# EAGLE design LEOPAD (EAGLE 9.0.1)
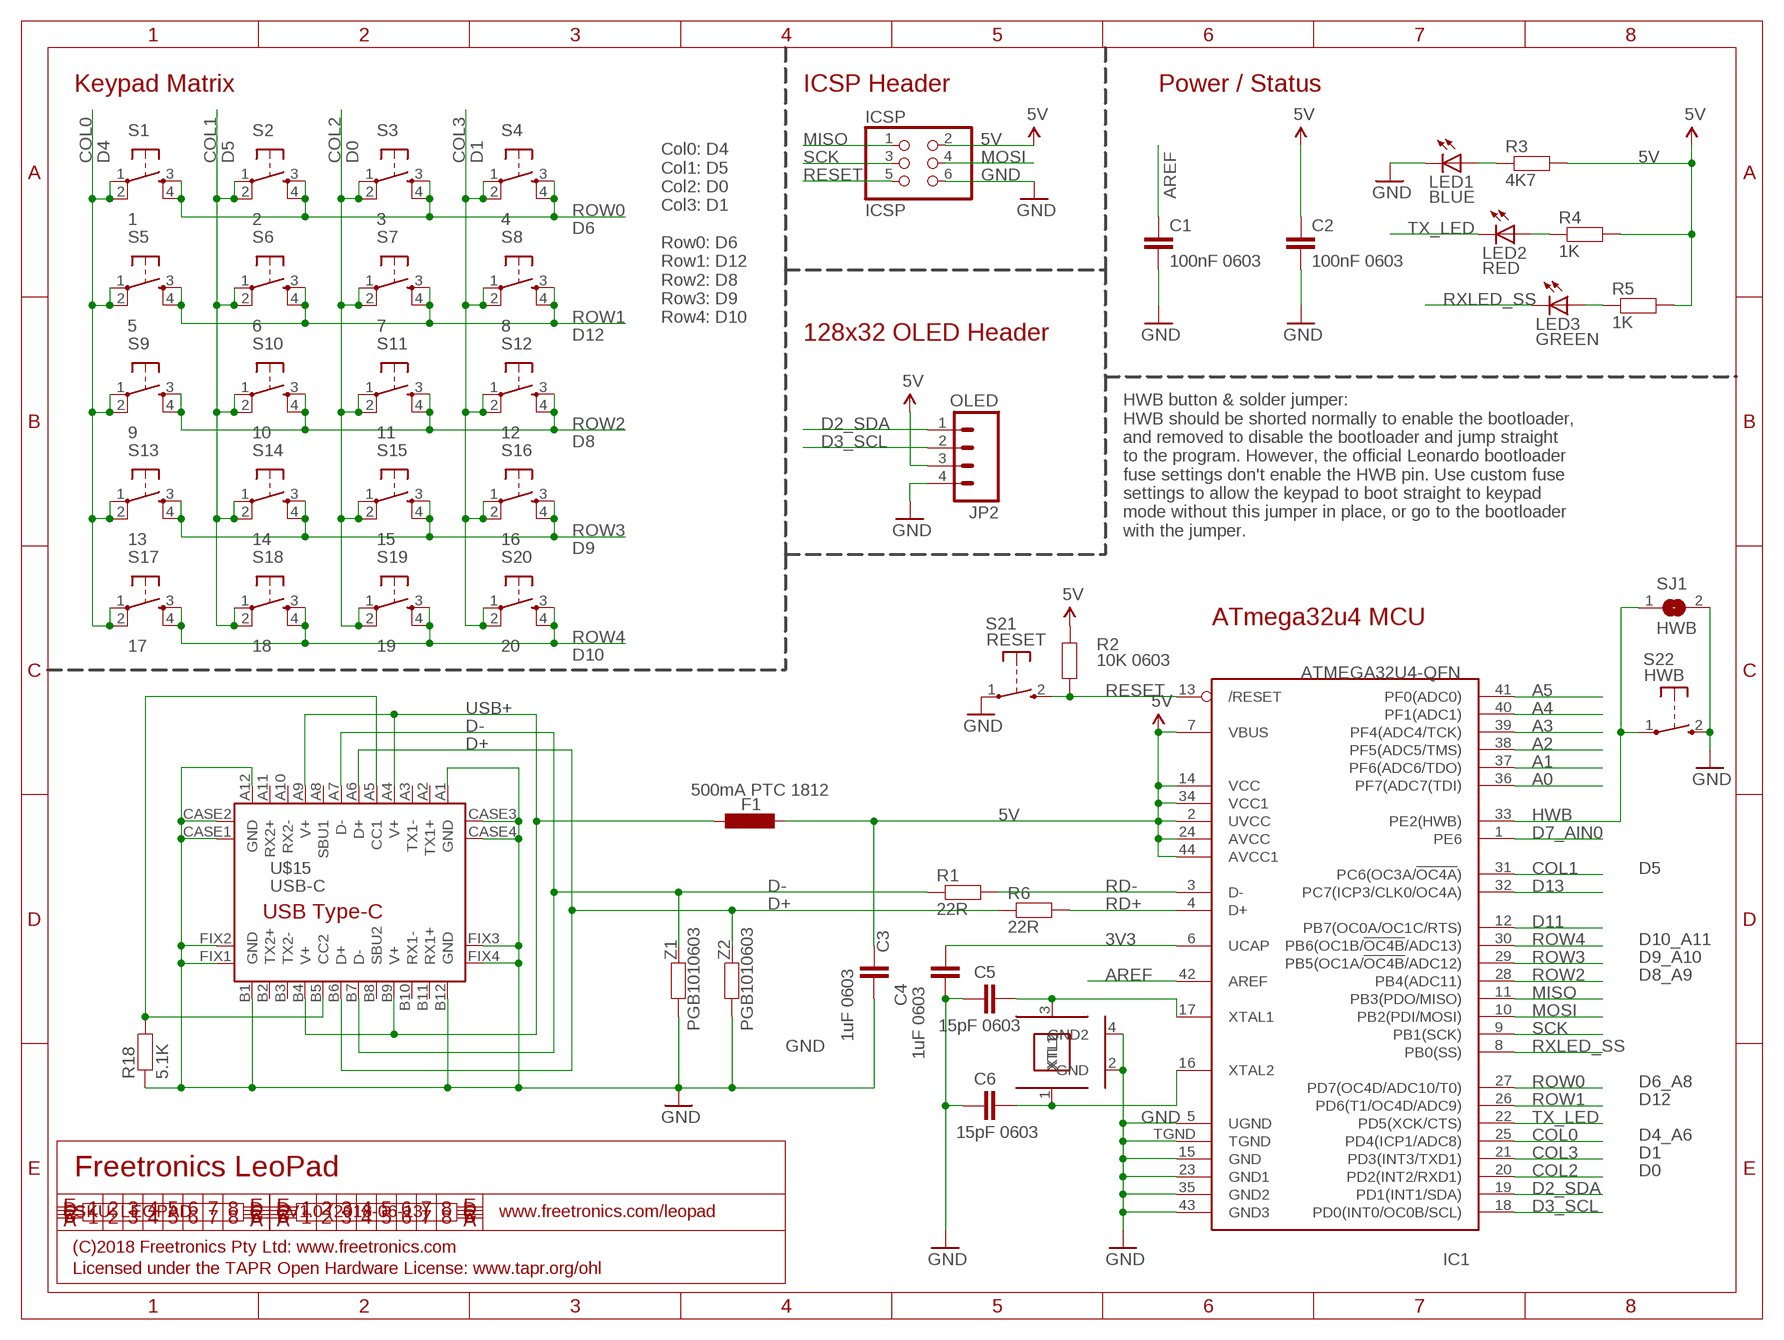
[diagram p0: schematic, sheet 1]

## Parts
C1  100nF 0603  CAP0603  [0603]
C2  100nF 0603  CAP0603  [0603]
C3  1uF 0603  CAP0603  [0603]
C4  1uF 0603  CAP0603  [0603]
C5  15pF 0603  CAP0603  [0603]
C6  15pF 0603  CAP0603  [0603]
F1  500mA PTC 1812  L-EUL1812  [L1812]
IC1  ATMEGA32U4-QFN  [QFN-44N]
ICSP  ICSP  PINHD-2X3  [2X03]
JP2  OLED  M04PTH  [1X04]
LED1  BLUE  LED0603  [LED-0603]
LED2  RED  LED0603  [LED-0603]
LED3  GREEN  LED0603  [LED-0603]
R1  22R  RESISTOR0603  [0603]
R2  10K 0603  RESISTOR0603  [0603]
R3  4K7  RESISTOR0603  [0603]
R4  1K  RESISTOR0603  [0603]
R5  1K  RESISTOR0603  [0603]
R6  22R  RESISTOR0603  [0603]
R18  5.1K  RESISTOR0603  [0603]
S1  1  TAC_SWITCH12  [TACTILE-PTH-12MM]
S2  2  TAC_SWITCH12  [TACTILE-PTH-12MM]
S3  3  TAC_SWITCH12  [TACTILE-PTH-12MM]
S4  4  TAC_SWITCH12  [TACTILE-PTH-12MM]
S5  5  TAC_SWITCH12  [TACTILE-PTH-12MM]
S6  6  TAC_SWITCH12  [TACTILE-PTH-12MM]
S7  7  TAC_SWITCH12  [TACTILE-PTH-12MM]
S8  8  TAC_SWITCH12  [TACTILE-PTH-12MM]
S9  9  TAC_SWITCH12  [TACTILE-PTH-12MM]
S10  10  TAC_SWITCH12  [TACTILE-PTH-12MM]
S11  11  TAC_SWITCH12  [TACTILE-PTH-12MM]
S12  12  TAC_SWITCH12  [TACTILE-PTH-12MM]
S13  13  TAC_SWITCH12  [TACTILE-PTH-12MM]
S14  14  TAC_SWITCH12  [TACTILE-PTH-12MM]
S15  15  TAC_SWITCH12  [TACTILE-PTH-12MM]
S16  16  TAC_SWITCH12  [TACTILE-PTH-12MM]
S17  17  TAC_SWITCH12  [TACTILE-PTH-12MM]
S18  18  TAC_SWITCH12  [TACTILE-PTH-12MM]
S19  19  TAC_SWITCH12  [TACTILE-PTH-12MM]
S20  20  TAC_SWITCH12  [TACTILE-PTH-12MM]
S21  RESET  TAC_SWITCH_2PINSMT  [TACTILE_SWITCH_SMD_2PIN_TINY]
S22  HWB  TAC_SWITCH_2PINSMT  [TACTILE_SWITCH_SMD_2PIN_TINY]
SJ1  HWB  SJN  [SJ]
U$15  USB-C  [USB-C-U52A]
XTL1  16MHz  CRYSTAL-GND3X2  [CRYSTAL-SMD-3X2]
Z1  PGB1010603  RESISTOR0603  [0603]
Z2  PGB1010603  RESISTOR0603  [0603]

## Nets
3V3: C4.2 IC1.6(UCAP)
5V: C2.1 C3.1 F1.2 IC1.2(UVCC) IC1.7(VBUS) IC1.14(VCC) IC1.24(AVCC) IC1.34(VCC1) IC1.44(AVCC1) ICSP.2 JP2.3 R2.2 R3.2 R4.2 R5.2
A0: IC1.36(PF7(ADC7(TDI))
A1: IC1.37(PF6(ADC6/TDO))
A2: IC1.38(PF5(ADC5/TMS))
A3: IC1.39(PF4(ADC4/TCK))
A4: IC1.40(PF1(ADC1))
A5: IC1.41(PF0(ADC0))
AREF: C1.1 IC1.42(AREF)
COL0: IC1.25(PD4(ICP1/ADC8)) S1.1 S1.2 S5.1 S5.2 S9.1 S9.2 S13.1 S13.2 S17.1 S17.2
COL1: IC1.31(PC6(OC3A/!OC4A!)) S2.1 S2.2 S6.1 S6.2 S10.1 S10.2 S14.1 S14.2 S18.1 S18.2
COL2: IC1.20(PD2(INT2/RXD1)) S3.1 S3.2 S7.1 S7.2 S11.1 S11.2 S15.1 S15.2 S19.1 S19.2
COL3: IC1.21(PD3(INT3/TXD1)) S4.1 S4.2 S8.1 S8.2 S12.1 S12.2 S16.1 S16.2 S20.1 S20.2
D2_SDA: IC1.19(PD1(INT1/SDA)) JP2.1
D3_SCL: IC1.18(PD0(INT0/OC0B/SCL)) JP2.2
D7_AIN0: IC1.1(PE6)
D11: IC1.12(PB7(OC0A/OC1C/RTS))
D13: IC1.32(PC7(ICP3/CLK0/OC4A))
D+: R6.1 U$15.A6(D+) U$15.B6(D+) Z2.2
D-: R1.1 U$15.A7(D-) U$15.B7(D-) Z1.2
GND: C1.2 C2.2 C3.2 C4.1 C5.1 C6.1 IC1.5(UGND) IC1.15(GND) IC1.23(GND1) IC1.35(GND2) IC1.43(GND3) IC1.TGND ICSP.6 JP2.4 LED1.C R18.1 S21.1(P) S22.2(S) SJ1.2 U$15.A1(GND) U$15.A12(GND) U$15.B1(GND) U$15.B12(GND) U$15.CASE1(GND) U$15.CASE2(GND) U$15.CASE3(GND) U$15.CASE4(GND) U$15.FIX1(GND) U$15.FIX2(GND) U$15.FIX3(GND) U$15.FIX4(GND) XTL1.2(GND) XTL1.4(GND2) Z1.1 Z2.1
HWB: IC1.33(PE2(HWB)) S22.1(P) SJ1.1
MISO: IC1.11(PB3(PDO/MISO)) ICSP.1
MOSI: IC1.10(PB2(PDI/MOSI)) ICSP.4
N$6: LED1.A R3.1
N$7: LED2.A R4.1
N$8: LED3.A R5.1
N$11: C5.2 IC1.17(XTAL1) XTL1.3(XTL2)
N$12: C6.2 IC1.16(XTAL2) XTL1.1(XTL1)
N$67: R18.2 U$15.A5(CC1) U$15.B5(CC2)
RD+: IC1.4(D+) R6.2
RD-: IC1.3(D-) R1.2
RESET: IC1.13(/RESET) ICSP.5 R2.1 S21.2(S)
ROW0: IC1.27(PD7(OC4D/ADC10/T0)) S1.3 S1.4 S2.3 S2.4 S3.3 S3.4 S4.3 S4.4
ROW1: IC1.26(PD6(T1/OC4D/ADC9)) S5.3 S5.4 S6.3 S6.4 S7.3 S7.4 S8.3 S8.4
ROW2: IC1.28(PB4(ADC11)) S9.3 S9.4 S10.3 S10.4 S11.3 S11.4 S12.3 S12.4
ROW3: IC1.29(PB5(OC1A/!OC4B!/ADC12)) S13.3 S13.4 S14.3 S14.4 S15.3 S15.4 S16.3 S16.4
ROW4: IC1.30(PB6(OC1B/!OC4B!/ADC13)) S17.3 S17.4 S18.3 S18.4 S19.3 S19.4 S20.3 S20.4
RXLED_SS: IC1.8(PB0(SS)) LED3.C
SCK: IC1.9(PB1(SCK)) ICSP.3
TX_LED: IC1.22(PD5(XCK/CTS)) LED2.C
USB+: F1.1 U$15.A4(V+) U$15.A9(V+) U$15.B4(V+) U$15.B9(V+)
Unconnected: U$15.A2(TX1+) U$15.A3(TX1-) U$15.A8(SBU1) U$15.A10(RX2-) U$15.A11(RX2+) U$15.B2(TX2+) U$15.B3(TX2-) U$15.B8(SBU2) U$15.B10(RX1-) U$15.B11(RX1+)

## Notes on the sheet
- Keypad Matrix | ICSP Header | Power / Status
- D4 | D5 | D0 | D1
- D6
- Col0: D4
  Col1: D5
  Col2: D0
  Col3: D1
  
  Row0: D6
  Row1: D12
  Row2: D8
  Row3: D9
  Row4: D10
- D12 | 128x32 OLED Header
- D8
- HWB button & solder jumper:
  HWB should be shorted normally to enable the bootloader,
  and removed to disable the bootloader and jump straight
  to the program. However, the official Leonardo bootloader
  fuse settings don't enable the HWB pin. Use custom fuse
  settings to allow the keypad to boot straight to keypad
  mode without this jumper in place, or go to the bootloader
  with the jumper.
- D9
- ATmega32u4 MCU
- D10
- D5
- D10_A11
- D9_A10
- D8_A9
- D6_A8
- D12
- D4_A6
- D1
- Freetronics LeoPad | D0
- SKU: LEOPAD | V1.0 (2018-06-13) | www.freetronics.com/leopad
- (C)2018 Freetronics Pty Ltd: www.freetronics.com
- Licensed under the TAPR Open Hardware License: www.tapr.org/ohl

## Library data of the parts
C1-C6 = freetronics-master-v1.1:CAP: Capacitor Standard 0603 ceramic capacitor, and 0.1" leaded capacitor.
F1 = rcl:L-EU: INDUCTOR, European symbol
IC1 = freetronics-jon:ATMEGA32U4: ATMEGA32U4
ICSP = pinhead:PINHD-2X3: PIN HEADER
JP2 = freetronics-jon:M04: Header 4 Standard 4-pin 0.1" header. Use with straight break away headers (SKU : PRT-00116), right angle break away headers (PRT-00553), swiss pins (PRT-00743), machine pins (PRT-00117), and female headers (PRT-00115). Molex polarized connector foot print use with SKU : PRT-08231 with associated crimp pins and housings. 1MM SMD Version SKU: PRT-10208
LED1-LED3 = freetronics-jon:LED: LEDs Standard schematic elements and footprints for 5mm, 3mm, 1206, and 0603 sized LEDs. 5mm - Spark Fun Electronics SKU : COM-00529 (and others)
R1 R3-R6 = freetronics-jon:RESISTOR: Resistor Basic schematic elements and footprints for 0603, 1206, and PTH 1/10th watt (small) resistors.
R2 Z1 Z2 = freetronics-master-v1.1:RESISTOR: Resistor Basic schematic elements and footprints for 0603, 1206, and PTH 1/10th watt (small) resistors.
R18 = freetronics-original:RESISTOR: Resistor Basic schematic elements and footprints for 0603, 1206, and PTH 1/10th watt (small) resistors.
S1-S20 = freetronics-jon:TAC_SWITCH: Momentary Switch Button commonly used for reset or general input. Spark Fun Electronics SKU : COM-00097
S21 S22 = freetronics-jon:TAC_SWITCH_2PIN: Momentary Tactile Switch - 2 pin
SJ1 = freetronics-jon:SJ: SMD solder JUMPER
U$15 = freetronics-jon:USB-C
XTL1 = freetronics-jon:CRYSTAL-GND

## Net classes
0 default: width 0.152 mm, drill 0.241 mm, clearance 0.152 mm

## Board
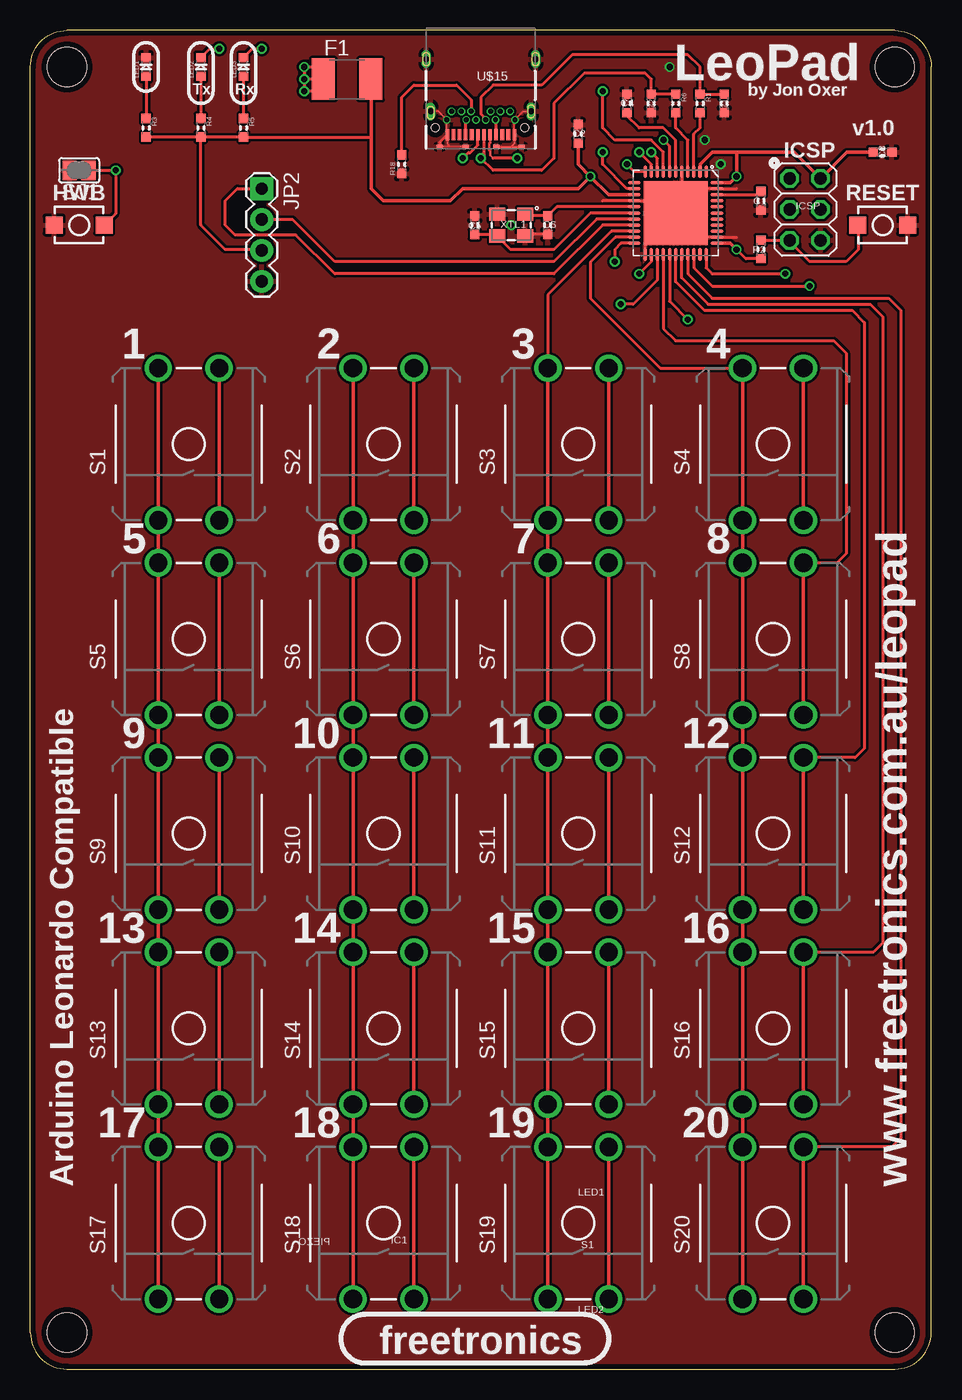
[diagram p1: board, top side]
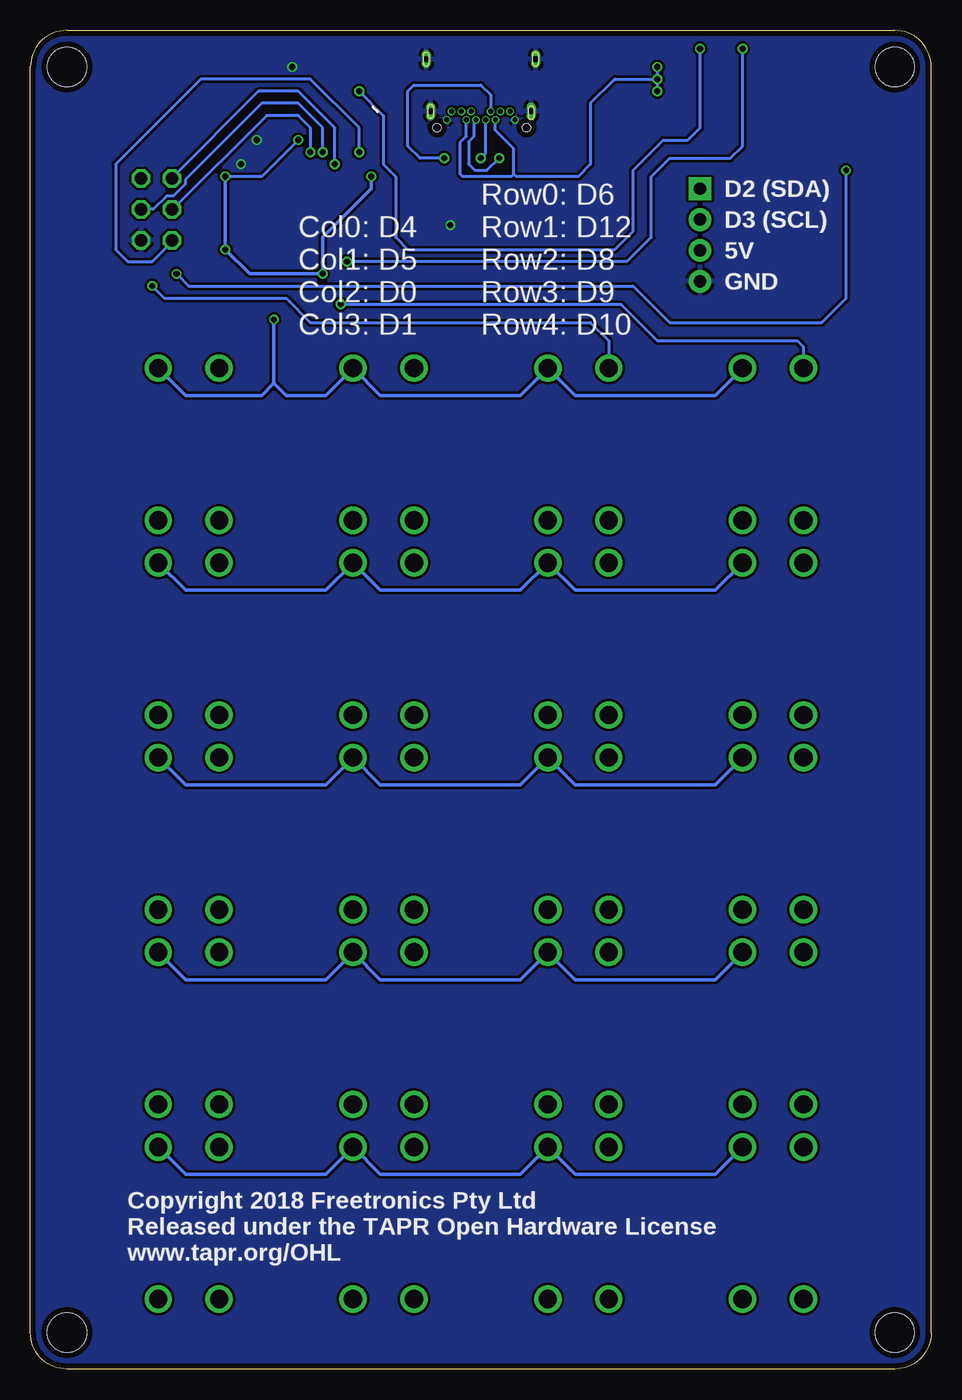
[diagram p2: board, bottom side, seen from below]

Size 74 x 110 mm. Coordinates in mm from the lower left corner, seen from the top.
Outline: 3,0 71,0 arc90 74,3 74,107 arc90 71,110 3,110 arc90 0,107 0,3 arc90 3,0
Copper layers (1*16): Top 0.035mm / dielectric 1.5mm / Bottom 0.035mm
Design rules "freetronics-design-rules": minimum track width 8mil, minimum drill 15mil, track to track 8mil, track to pad 8mil, pad to pad 8mil, via to via 8mil, smd to smd 6mil, copper to edge 18mil, drill to drill 8mil, minimum pad ring 4mil, minimum via ring 6mil, stop-mask expansion 4mil, vias tented up to drill 25mil, thermal gap 10mil
Holes 3.2 mm at 3,107 71,107 3,3 71,3

### Footprints (pad centres in the part's own frame; a part is rotated, then mirrored left to right if it is on the bottom)
0603 = smd 0.762 x 0.762: 1 -0.762,0; 2 0.762,0
L1812 = smd 1.9 x 3.4: 1 -1.95,0; 2 1.95,0
QFN-44N = smd 0.3 x 1.05: 1 -2.5,-3.4; 2 -2,-3.4; 3 -1.5,-3.4; 4 -1,-3.4; 5 -0.5,-3.4; 6 0,-3.4; 7 0.5,-3.4; 8 1,-3.4; 9 1.5,-3.4; 10 2,-3.4; 11 2.5,-3.4; 23 2.5,3.4; 24 2,3.4; 25 1.5,3.4; 26 1,3.4; 27 0.5,3.4; 28 0,3.4; 29 -0.5,3.4; 30 -1,3.4; 31 -1.5,3.4; 32 -2,3.4; 33 -2.5,3.4 | smd 1.05 x 0.3: 12 3.4,-2.5; 13 3.4,-2; 14 3.4,-1.5; 15 3.4,-1; 16 3.4,-0.5; 17 3.4,0; 18 3.4,0.5; 19 3.4,1; 20 3.4,1.5; 21 3.4,2; 22 3.4,2.5; 34 -3.4,2.5; 35 -3.4,2; 36 -3.4,1.5; 37 -3.4,1; 38 -3.4,0.5; 39 -3.4,0; 40 -3.4,-0.5; 41 -3.4,-1; 42 -3.4,-1.5; 43 -3.4,-2; 44 -3.4,-2.5 | smd 5.25 x 5.25: TGND 0,0
2X03 = drill 1.016 octagon: 1 -2.54,-1.27; 2 -2.54,1.27; 3 0,-1.27; 4 0,1.27; 5 2.54,-1.27; 6 2.54,1.27
1X04 = drill 1.016 pad 1.88 square: 1 0,0 | drill 1.016 pad 1.88: 2 2.54,0; 3 5.08,0; 4 7.62,0
LED-0603 = smd 0.762 x 0.762: A -0.762,0; C 0.762,0
TACTILE-PTH-12MM = drill 1.5: 1 -6.25,2.5; 2 6.25,2.5; 3 -6.25,-2.5; 4 6.25,-2.5
TACTILE_SWITCH_SMD_2PIN_TINY = smd 1.4 x 1.4: 1 -2.05,0; 2 2.05,0
SJ = smd 1.168 x 1.6: 1 -0.762,0; 2 0.762,0
USB-C-U52A = smd 0.3 x 0.9: A1 0.85,0.56; A2 1.35,0.56; A3 1.85,0.56; A4 2.35,0.56; A5 2.85,0.56; A6 3.35,0.56; A7 3.85,0.56; A8 4.35,0.56; A9 4.85,0.56; A10 5.35,0.56; A11 5.85,0.56; A12 6.35,0.56 | drill 0.4 pad 0.6: B1 6.4,-0.65; B2 6,-1.35; B3 5.2,-1.35; B4 4.8,-0.65; B5 4.4,-1.35; B6 4,-0.65; B7 3.2,-0.65; B8 2.8,-1.35; B9 2.4,-0.65; B10 2,-1.35; B11 1.2,-1.35; B12 0.8,-0.65 | smd 0.5 x 0.3: CASE1 0.23,1.55; CASE2 2.35,1.55; CASE3 4.85,1.55; CASE4 6.98,1.55 | drill 0.5 pad 0.7 long: FIX1 -0.89,-5.64; FIX2 -0.53,-1.35; FIX3 7.73,-1.35; FIX4 8.09,-5.64 | hole 0.65: 7.35,0; 0,0
CRYSTAL-SMD-3X2 = smd 1.3 x 1.1: 1 -1.15,-0.9; 2 1.15,-0.9; 3 1.15,0.9; 4 -1.15,0.9

### Placement (x,y rotation side)
C1  60,96 270 top
C2  45,101.5 90 top
C3  70,100 0 top
C4  49,104 270 top
C5  36.5,94 270 top
C6  42.5,94 90 top
F1  26,106 0 top
IC1  53,95 180 top
ICSP  63.64,95.3 270 top
JP2  19,97 270 top
LED1  9.5,107 90 top
LED2  14,107 90 top
LED3  17.5,107 90 top
R1  55,104 270 top
R2  60,92 270 top
R3  9.5,102 270 top
R4  14,102 270 top
R5  17.5,102 270 top
R6  53,104 270 top
R18  30.5,99 90 top
S1  13,76 90 top
S2  29,76 90 top
S3  45,76 90 top
S4  61,76 90 top
S5  13,60 90 top
S6  29,60 90 top
S7  45,60 90 top
S8  61,60 90 top
S9  13,44 90 top
S10  29,44 90 top
S11  45,44 90 top
S12  61,44 90 top
S13  13,28 90 top
S14  29,28 90 top
S15  45,28 90 top
S16  61,28 90 top
S17  13,12 90 top
S18  29,12 90 top
S19  45,12 90 top
S20  61,12 90 top
S21  70,94 180 top
S22  4,94 180 top
SJ1  4,98.5 180 top
U$15  40.6,102 180 top
XTL1  39.5,94 180 top
Z1  57,104 90 top
Z2  51,104 90 top

### Tracks (layer width: path | path; a pad name or v marks a point on that pad's centre or on a via)
3V3
  Top 0.254: IC1.6 53,101 52,102 50,102 49,103 C4.2
5V  (via drill 0.5)
  Top 0.254: IC1.7 52.5,100.5 v52,101 | R2.2 58.76,91.24 v58,92 | IC1.24 51,91 v50,90 | JP2.3 18.92,92 16,92 14,94 R4.2 | R4.2 R5.2 28,101.24 28,101 | R4.2 R3.2
  Top 0.305: ICSP.2 64.95,97.88 | IC1.34 57.5,92.5 v58,92 | IC1.44 57.5,97.5 v58,98 58,100 | IC1.2 55,99 56,100 58,100 | IC1.14 47.5,96.5 v46,98 | v46,98 45,99 C2.1 | F1.2 28,105.95 28,101 28,97 29,96 34.5,96 35.5,97 45,97 v46,98 | ICSP.2 62.75,100 58,100 | C3.1 67.07,100 ICSP.2
  Bottom 0.254: v52,101 55,98 v58,98
  Bottom 0.305: v58,98 v58,92 56,90 v50,90 50,93 46,97 v46,98
AREF
  Top 0.254: IC1.42 59.74,96.5 C1.1
COL0  (via drill 0.5)
  Top 0.254: IC1.25 51.5,89.5 49.5,87.5 v48.5,87.5
  Top 0.305: S1.2 S1.1 S5.2 S5.1 S9.2 S9.1 S13.2 S13.1 S17.2 S17.1
  Bottom 0.254: v48.5,87.5 25.5,87.5 22.5,84.5 11,84.5 10.5,84 S1.2
COL1  (via drill 0.5)
  Top 0.254: IC1.31 54.5,90.5 56,89 v64,89
  Top 0.305: S2.2 S2.1 S6.2 S6.1 S10.2 S10.1 S14.2 S14.1 S18.2 S18.1
  Bottom 0.254: v64,89 63,88 53,88 51,86 28,86 26.5,84.5 S2.2
COL2
  Top 0.254: IC1.20 47.72,93.5 42.5,88.28 S3.2
  Top 0.305: S3.2 S3.1 S7.2 S7.1 S11.2 S11.1 S15.2 S15.1 S19.2 S19.1
COL3
  Top 0.254: IC1.21 48.05,93 46,90.95 46,88 51.75,82.25 S4.2
  Top 0.305: S4.2 S4.1 S8.2 S8.1 S12.2 S12.1 S16.2 S16.1 S20.2 S20.1
D2_SDA
  Top 0.254: IC1.19 47,94 43,90 25,90 21.81,93.19 16.81,93.19 16,94 16,96 17,97 JP2.1
D3_SCL
  Top 0.254: IC1.18 46.5,94.5 43,91 25,91 21.54,94.46 JP2.2
D+  (via drill 0.5)
  Top 0.254: R6.1 Z2.2 51,106 50.5,106.5 45.5,106.5 43,104 43,99.5 42,98.5 38,98.5 v37,99.5 37.25,99.75 U$15.A6
  Bottom 0.254: v37,99.5 36.6,99.9 U$15.B6
D-  (via drill 0.5)
  Top 0.254: Z1.2 R1.1 55,107 54,108 44.5,108 42,105.5 38,105.5 37,104.5 37,103.14 37.23,102.91 37.23,102.82 U$15.B7 | v35.5,99.5 35.97,99.97 36.14,99.97 36.75,100.58 U$15.A7
  Bottom 0.254: U$15.B7 37.57,102.48 37.57,101.28 38,100.85 38,99 37.5,98.5 36.5,98.5 v35.5,99.5
GND  (via drill 0.5, 0.5 pad 0.5)
  Top 0.152: 34.2,101.49 U$15.B1 33.5,103.35 U$15.FIX3 | U$15.FIX2 40.5,103.35 U$15.B12 39.74,102.59 39.74,101.64 39.75,101.64 U$15.A1 39.75,100.7 39.5,100.45 | U$15.CASE2 39.5,100.45 | 39.5,100.45 U$15.CASE1 | U$15.CASE3 34.5,100.45 | 34.5,100.45 U$15.CASE4 | U$15.A12 34.25,100.7 34.5,100.45
  Top 0.254: IC1.TGND 55,93 IC1.35 58,93 | IC1.5 53.5,97 | 53.5,97 53.5,95.5 IC1.TGND | IC1.TGND 52,96 IC1.15 47,96 | 53.5,97 IC1.43 58,97 | IC1.23 50.5,93.5 52,95 IC1.TGND | C6.1 40.79,93.24 XTL1.4 | U$15.A12 33.62,100.81 U$15.CASE4
  other vias: 39.5,94 56.7,99 55.4,101 52.5,107
  pour Bottom: 0,107 arc-90 3,110 71,110 arc-90 74,107 74,3 arc-74 71,0 3,0 arc-74 0,3
  pour Top: 0,107 arc-90 3,110 71,110 arc-90 74,107 74,3 arc-74 71,0 3,0 arc-74 0,3
HWB  (via drill 0.5)
  Top 0.254: IC1.33 55.5,90.5 56,90 v62,90 | S22.1 7,94.95 v7,98.5 SJ1.1
  Bottom 0.254: v62,90 61,89 24.5,89 21.5,86 9,86 7,88 v7,98.5
MISO  (via drill 0.5)
  Top 0.254: IC1.11 49.6,98.4 v49,99
  Bottom 0.254: v49,99 49,102 52,105 55.28,105 62.45,97.84 ICSP.1
MOSI  (via drill 0.5)
  Top 0.254: IC1.10 51,99 v50,100
  Bottom 0.203: 65.09,95.3 ICSP.4
  Bottom 0.254: v50,100 50,102 52,104 55,104 61.28,97.72 61.28,97.38 62.27,96.39 62.82,96.39 63.91,95.3 ICSP.4
N$6
  Top 0.254: LED1.A R3.1
N$7
  Top 0.254: LED2.A R4.1
N$8
  Top 0.254: LED3.A R5.1
N$11
  Top 0.254: IC1.17 46,95 43,92 39.45,92 XTL1.3 38.21,93.24 C5.2
N$12
  Top 0.254: 40.61,94.72 XTL1.1 40.79,94.76 C6.2 43.24,95.5 IC1.16
N$67  (via drill 0.5)
  Top 0.203: 38,99.5 37.75,99.75 37.75,100.12 37.7,100.17 37.7,100.73 37.75,100.78 U$15.A5
  Top 0.254: R18.2 30.5,104.5 31.5,105.5 35,105.5 36.2,104.3 U$15.B5 | v40,99.5 38,99.5
  Bottom 0.254: v40,99.5 42,99.5 43,100.5 43,105 42.5,105.5 37,105.5 36.2,104.7 U$15.B5
RD+
  Top 0.254: IC1.4 54,101 53,102 R6.2
RD-
  Top 0.254: IC1.3 54.5,101.5 55,102 R1.2
RESET  (via drill 0.5)
  Top 0.254: IC1.13 49,97 47,99 v47,100 | R2.1 62.24,92.76 62.37,92.63 | S21.2 68,93.95 68,92 67,91 64,91 62.37,92.63 | 62.37,92.63 ICSP.5
  Bottom 0.254: v47,100 47,102 51,106 60,106 67,99 67,92 66,91 64,91 62.37,92.63 ICSP.5
ROW0  (via drill 0.5)
  Top 0.254: IC1.27 52.5,87.75 v54,86.25
  Top 0.305: S1.3 S1.4 | S4.3 S4.4 | S2.4 S2.3 | S3.3 S3.4
  Bottom 0.305: S1.4 17.75,80 29.25,80 S2.4 33.75,80 45.25,80 S3.4 49.75,80 53,80 54,81 | S4.4 61.25,80 55,80 54,81 | v54,86.25 54,81
ROW1
  Top 0.254: S8.4 66.25,66.25 67,67 67,83.5 66,84.5 53,84.5 52,85.5 IC1.26
  Top 0.305: S5.3 S5.4 | S8.3 S8.4 | S7.4 S7.3 | S6.4 S6.3
  Bottom 0.305: S5.4 17.75,64 29.25,64 S6.4 33.75,64 45.25,64 S7.4 49.75,64 61.25,64 S8.4
ROW2
  Top 0.254: IC1.28 53,89.35 55.35,87 67.5,87 68.5,86 68.5,51 67.75,50.25 S12.4
  Top 0.305: S9.3 S9.4 | S10.4 S10.3 | S11.4 S11.3 | S12.4 S12.3
  Bottom 0.305: S9.4 17.75,48 29.25,48 S10.4 33.75,48 45.25,48 S11.4 49.75,48 61.25,48 S12.4
ROW3
  Top 0.254: IC1.29 53.5,89.67 55.67,87.5 69,87.5 70,86.5 70,35 69.25,34.25 S16.4
  Top 0.305: S13.4 S13.3 | S14.4 S14.3 | S15.4 S15.3 | S16.4 S16.3
  Bottom 0.305: S13.4 17.75,32 29.25,32 S14.4 33.75,32 45.25,32 S15.4 49.75,32 61.25,32 S16.4
ROW4
  Top 0.254: IC1.30 54,90 56,88 70.5,88 71.5,87 71.5,19 70.75,18.25 S20.4
  Top 0.305: S20.4 S20.3 | S19.4 S19.3 | S18.4 S18.3 | S17.4 S17.3
  Bottom 0.305: S17.4 17.75,16 29.25,16 S18.4 33.75,16 45.25,16 S19.4 49.75,16 61.25,16 S20.4
RXLED_SS  (via drill 0.5)
  Top 0.254: IC1.8 52,100 51,101 48,101 47,102 v47,105 | LED3.C 18.24,108.5 v19,108.5
  Bottom 0.254: v47,105 45,103 45,99 44,98 44,93 43,92 26,92 24.5,93.5 24.5,98.5 22,101 20,101 19,102 v19,108.5
SCK  (via drill 0.5)
  Top 0.254: IC1.9 51.5,99.5 v51,100
  Bottom 0.254: v51,100 51,102 52,103 54.6,103 62.3,95.3 ICSP.3
TX_LED  (via drill 0.5)
  Top 0.254: IC1.22 48.5,92.5 48,92 v48,91 | LED2.C 14.74,108.5 v15.5,108.5
  Bottom 0.254: v48,91 25,91 23,93 23,98 21.5,99.5 16.5,99.5 15.5,100.5 v15.5,108.5
USB+  (via drill 0.5)
  Top 0.254: U$15.A9 35.75,102.6 U$15.B4 | U$15.A4 38.25,102.6 U$15.B9 | v22.5,106 v22.5,107 24,107 24.05,106.95 F1.1 24.05,105.05 24,105 v22.5,105 v22.5,106 | 24,106 v22.5,106
  Bottom 0.254: 34.3,98.2 34.5,98 38.5,98 38.7,98.2 38.7,100.8 38.2,101.3 U$15.B9 | v22.5,107 v22.5,106 | 34.3,98.2 34.1,98 29,98 28,99 28,104 26,106 v22.5,106 | v22.5,106 v22.5,105 | 34.3,98.2 34.3,100.3 35.8,101.8 U$15.B4

### Text on the board
tPlace: LeoPad | Tx | Rx | by Jon Oxer | v1.0 | ICSP | HWB | RESET | 1 | 2 | 3 | 4 | 5 | 6 | 7 | 8 | 9 | 10 | 11 | 12 | 13 | 14 | 15 | 16 | 17 | 18 | 19 | 20 | Arduino Leonardo Compatible | www.freetronics.com.au/leopad | freetronics
bPlace: D2 (SDA) | D3 (SCL) | 5V | GND | Row0: D6 / Row1: D12 / Row2: D8 / Row3: D9 / Row4: D10 | Col0: D4 / Col1: D5 / Col2: D0 / Col3: D1 | Copyright 2018 Freetronics Pty Ltd / Released under the TAPR Open Hardware License / www.tapr.org/OHL
tNames: LED1 | PIEZO | IC1 | S1 | LED2